# EAGLE design SNES (EAGLE 9.6.2)
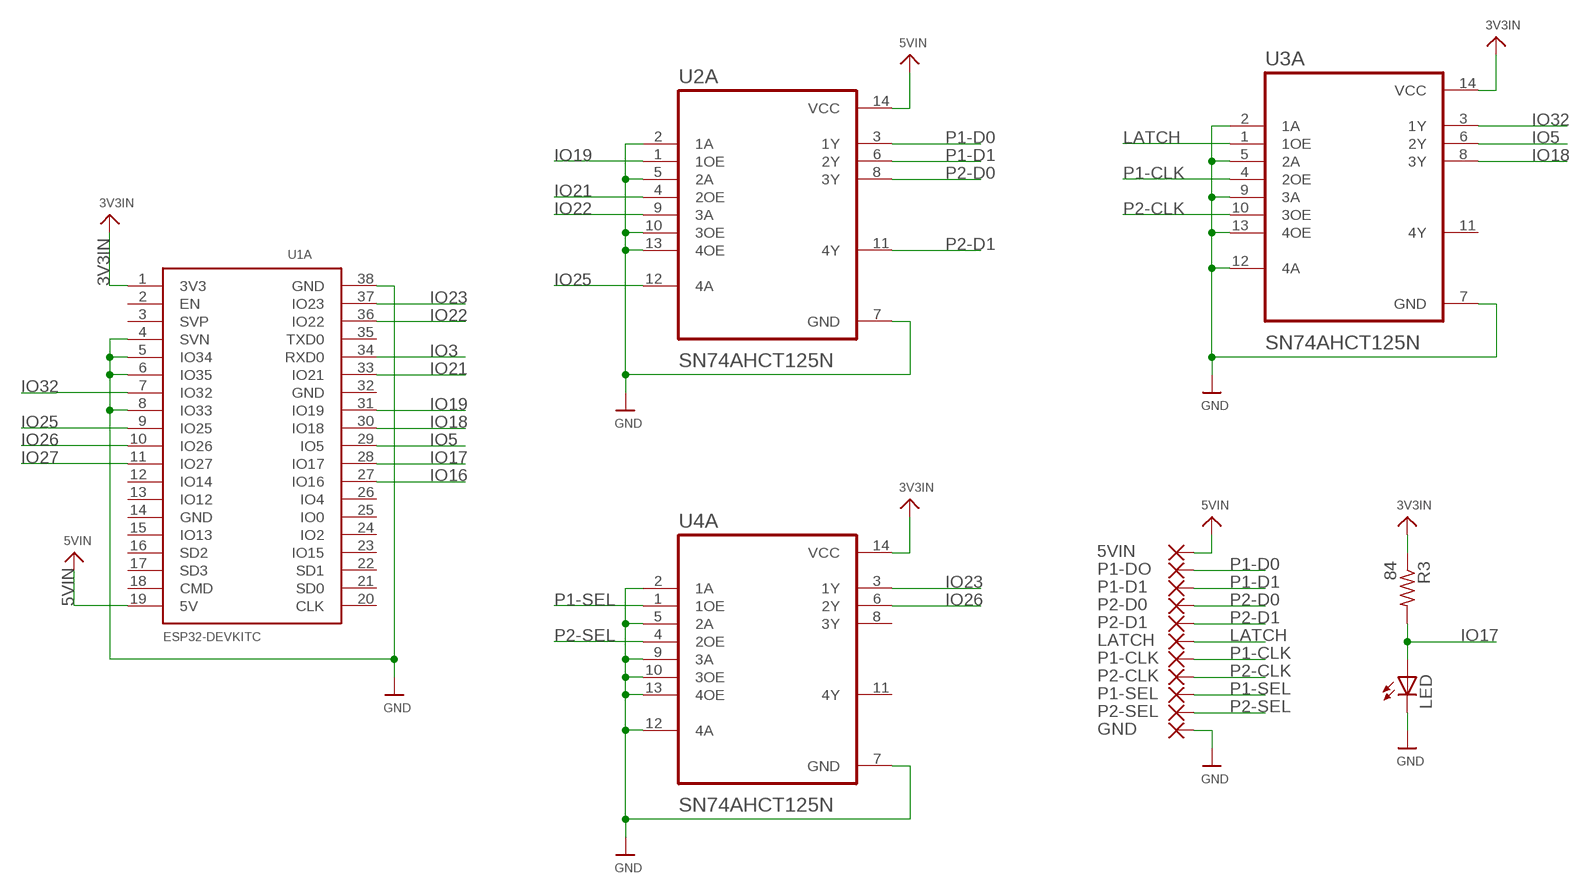
[diagram p0: schematic, sheet 1]

## Parts
5VIN  SMD5  [SMD2,54-5,08]
GND  SMD5  [SMD2,54-5,08]
LATCH  SMD5  [SMD2,54-5,08]
LED  LEDCHIPLED_1206  [CHIPLED_1206]
P1-CLK  SMD5  [SMD2,54-5,08]
P1-D1  SMD5  [SMD2,54-5,08]
P1-DO  SMD5  [SMD2,54-5,08]
P1-SEL  SMD5  [SMD2,54-5,08]
P2-CLK  SMD5  [SMD2,54-5,08]
P2-D0  SMD5  [SMD2,54-5,08]
P2-D1  SMD5  [SMD2,54-5,08]
P2-SEL  SMD5  [SMD2,54-5,08]
R3  84  R-US_R1206  [R1206]
U1A  ESP32DEVKITC  [ESP32-DEVKITC]
U2A  SN74AHCT125N  [DIP794W45P254L1969H508Q14]
U3A  SN74AHCT125N  [DIP794W45P254L1969H508Q14]
U4A  SN74AHCT125N  [DIP794W45P254L1969H508Q14]

## Nets
3V3IN: R3.1 U1A.1(3V3) U3A.14(VCC) U4A.14(VCC)
5VIN: 5VIN.1(P) U1A.19(5V) U2A.14(VCC)
GND: GND.1(P) LED.C U1A.4(SVN) U1A.5(IO34) U1A.6(IO35) U1A.8(IO33) U1A.38(GND) U2A.2(1A) U2A.5(2A) U2A.7(GND) U2A.10(3OE) U2A.13(4OE) U3A.2(1A) U3A.5(2A) U3A.7(GND) U3A.9(3A) U3A.12(4A) U3A.13(4OE) U4A.2(1A) U4A.5(2A) U4A.7(GND) U4A.9(3A) U4A.10(3OE) U4A.12(4A) U4A.13(4OE)
IO3: U1A.34(RXD0)
IO5: U1A.29(IO5) U3A.6(2Y)
IO16: U1A.27(IO16)
IO17: LED.A R3.2 U1A.28(IO17)
IO18: U1A.30(IO18) U3A.8(3Y)
IO19: U1A.31(IO19) U2A.1(1OE)
IO21: U1A.33(IO21) U2A.4(2OE)
IO22: U1A.36(IO22) U2A.9(3A)
IO23: U1A.37(IO23) U4A.3(1Y)
IO25: U1A.9(IO25) U2A.12(4A)
IO26: U1A.10(IO26) U4A.6(2Y)
IO27: U1A.11(IO27)
IO32: U1A.7(IO32) U3A.3(1Y)
LATCH: LATCH.1(P) U3A.1(1OE)
P1-CLK: P1-CLK.1(P) U3A.4(2OE)
P1-D0: P1-DO.1(P) U2A.3(1Y)
P1-D1: P1-D1.1(P) U2A.6(2Y)
P1-SEL: P1-SEL.1(P) U4A.1(1OE)
P2-CLK: P2-CLK.1(P) U3A.10(3OE)
P2-D0: P2-D0.1(P) U2A.8(3Y)
P2-D1: P2-D1.1(P) U2A.11(4Y)
P2-SEL: P2-SEL.1(P) U4A.4(2OE)
Unconnected: U1A.2(EN) U1A.3(SVP) U1A.12(IO14) U1A.13(IO12) U1A.14(GND) U1A.15(IO13) U1A.16(SD2) U1A.17(SD3) U1A.18(CMD) U1A.20(CLK) U1A.21(SD0) U1A.22(SD1) U1A.23(IO15) U1A.24(IO2) U1A.25(IO0) U1A.26(IO4) U1A.32(GND) U1A.35(TXD0) U3A.11(4Y) U4A.8(3Y) U4A.11(4Y)

## Library data of the parts
5VIN GND LATCH P1-CLK P1-D1 P1-DO P1-SEL P2-CLK P2-D0 P2-D1 P2-SEL = wirepad:SMD5: SMD PAD
LED = adafruit:LED: LED OSRAM: - CHIPLED LG R971, LG N971, LY N971, LG Q971, LY Q971, LO R971, LY R971 LH N974, LH R974 LS Q976, LO Q976, LY Q976 LO Q996 - Hyper CHIPLED LW Q18S LB Q993, LB Q99A, LB R99A - SideLED LS A670, LO A670, LY A670, LG A670, LP A670 LB A673, LV A673, LT A673, LW A673 LH A674 LY A675 LS A676, LA A676, LO A676, LY A676, LW A676 LS A679, LY A679, LG A679 - Hyper Micro SIDELED® LS Y876, LA Y876, LO Y876, LY Y876 LT Y87S - SmartLED LW L88C, LW L88S LB L89C, LB L89S, LG L890 LS L89K, LO L89K, LY L89K LS L896, LA L896, LO L896, LY L896 - TOPLED LS T670, LO T670, LY T670, LG T670, LP T670 LSG T670, LSP T670, LSY T670, LOP T670, LYG T670 LG T671, LOG T671, LSG T671 LB T673, LV T673, LT T673, LW T673 LH T674 LS T676, LA T676, LO T676, LY T676, LB T676, LH T676, LSB T676, LW T676 LB T67C, LV T67C, LT T67C, LS T67K, LO T67K, LY T67K, LW E67C LS E67B, LA E67B, LO E67B, LY E67B, LB E67C, LV E67C, LT E67C LW T67C LS T679, LY T679, LG T679 LS T770, LO T770, LY T770, LG T770, LP T770 LB T773, LV T773, LT T773, LW T773 LH T774 LS E675, LA E675, LY E675, LS T675 LS T776, LA T776, LO T776, LY T776, LB T776 LHGB T686 LT T68C, LB T68C - Hyper Mini TOPLED® LB M676 - Mini TOPLED Santana® LG M470 LS M47K, LO M47K, LY M47K Source: http://www.osram.convergy.de/
R3 = adafruit:R-US_: RESISTOR, American symbol
U1A = ESP32-DEVKITC:ESP32DEVKITC
U2A U3A U4A = SN74AHCT125N:SN74AHCT125N: None Check prices <https://pricing.snapeda.com/parts/SN74AHCT125N/Texas%20Instruments/view-part?ref=eda>; AVAILABILITY: In Stock; DESCRIPTION: Quadruple Bus Buffer Gates With 3-State Outputs 14-PDIP -40 to 125; MF: Texas Instruments; MP: SN74AHCT125N; PACKAGE: PDIP-14 Texas Instruments; PRICE: None; PURCHASE-URL: https://pricing.snapeda.com/search/part/SN74AHCT125N/?ref=eda

## Board
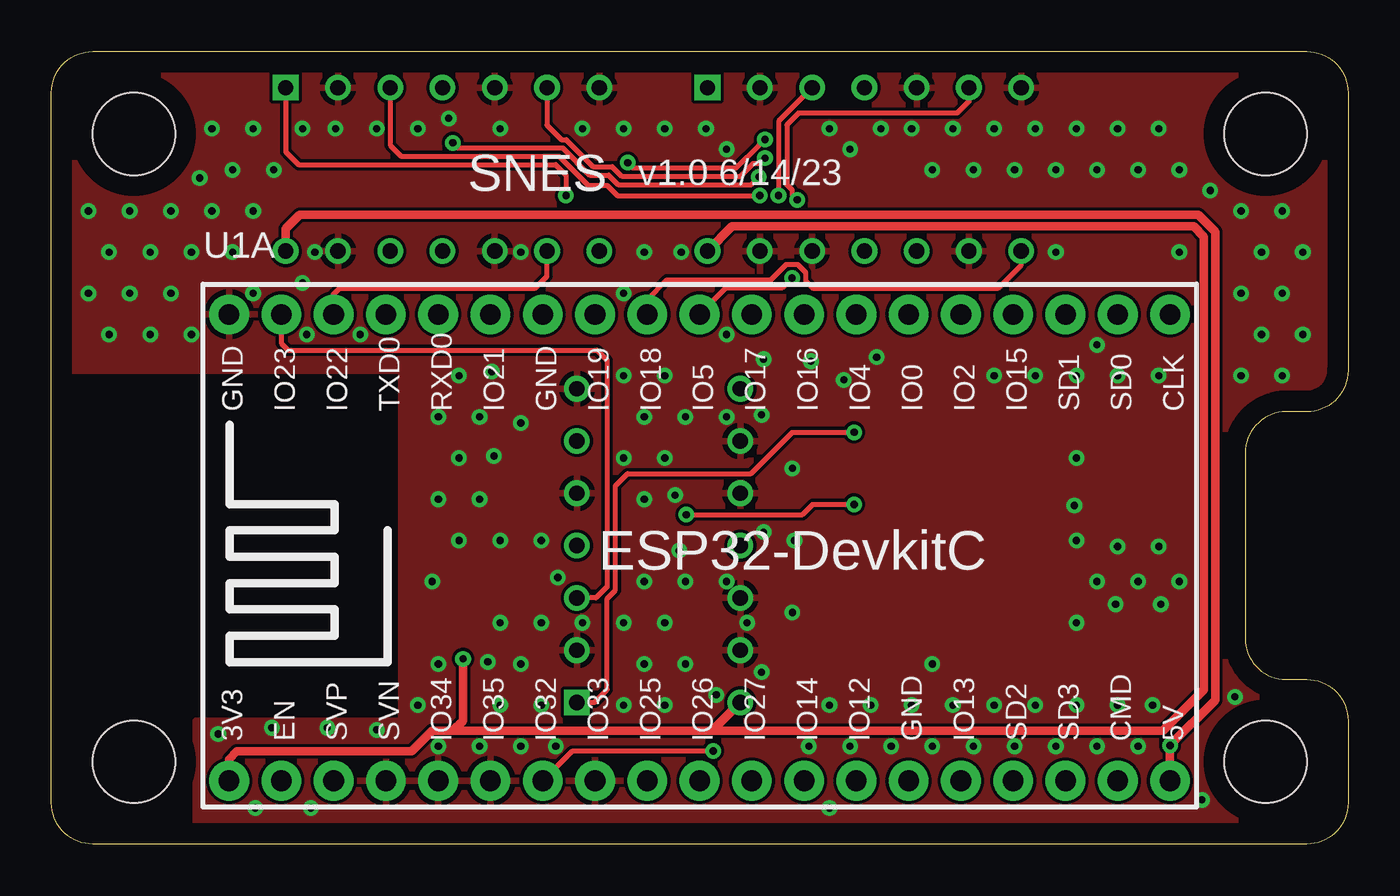
[diagram p1: board, top side]
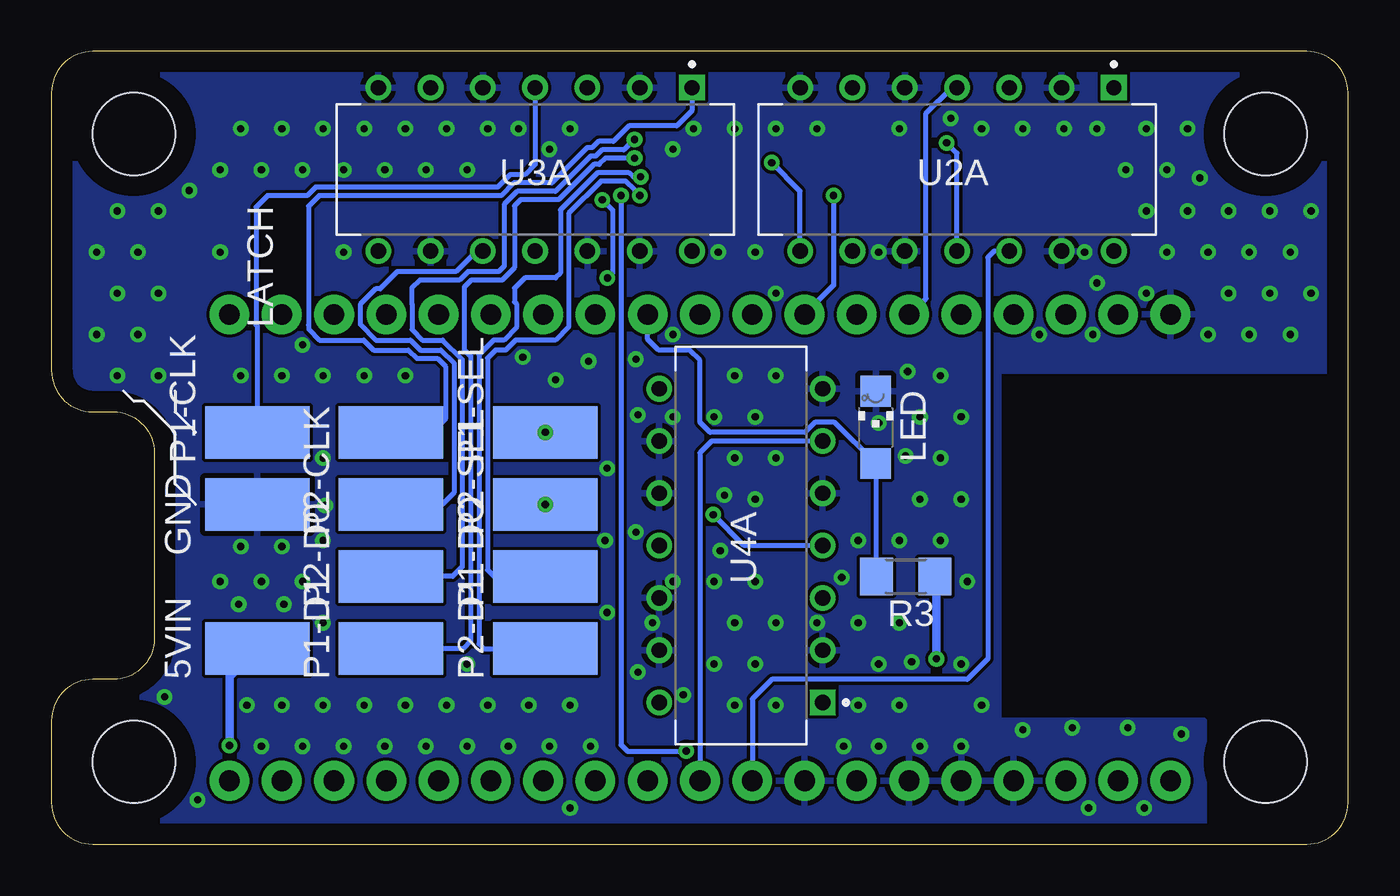
[diagram p2: board, bottom side, seen from below]

Size 63 x 38.5 mm. Coordinates in mm from the lower left corner, seen from the top.
Outline: 0,2 0,36.5 arc-90 2,38.5 61,38.5 arc-90 63,36.5 63,23 arc-90 61,21 60,21 arc90 58,19 58,10 arc90 60,8 61,8 arc-90 63,6 63,2 arc-90 61,0 2,0 arc-90 0,2
Copper layers (1*16): Top 0.035mm / dielectric 1.5mm / Bottom 0.035mm
Design rules "default": minimum track width 6mil, minimum drill 0.35mm, track to track 6mil, track to pad 6mil, pad to pad 6mil, via to via 6mil, smd to smd 6mil, copper to edge 40mil, drill to drill 6mil, minimum pad ring 10mil, minimum via ring 8mil, stop-mask expansion 4mil, vias tented up to drill 0.5mm, thermal gap 10mil
Holes 4 mm at 4,4 4,34.5 59,34.5 59,4

### Footprints (pad centres in the part's own frame; a part is rotated, then mirrored left to right if it is on the bottom)
SMD2,54-5,08 = smd 2.54 x 5.08: 1 0,0
CHIPLED_1206 = smd 1.5 x 1.5: A 0,-1.75; C 0,1.75
R1206 = smd 1.6 x 1.803: 1 -1.422,0; 2 1.422,0
ESP32-DEVKITC = drill 1 pad 1.93: 1 -22.87,-11.42; 2 -20.33,-11.42; 3 -17.79,-11.42; 4 -15.25,-11.42; 5 -12.71,-11.42; 6 -10.17,-11.42; 7 -7.63,-11.42; 8 -5.09,-11.42; 9 -2.55,-11.42; 10 -0.01,-11.42; 11 2.53,-11.42; 12 5.07,-11.42; 13 7.61,-11.42; 14 10.15,-11.42; 15 12.69,-11.42; 16 15.23,-11.42; 17 17.77,-11.42; 18 20.31,-11.42; 19 22.85,-11.42; 20 22.85,11.23; 21 20.31,11.23; 22 17.77,11.23; 23 15.23,11.23; 24 12.69,11.23; 25 10.15,11.23; 26 7.61,11.23; 27 5.07,11.23; 28 2.53,11.23; 29 -0.01,11.23; 30 -2.55,11.23; 31 -5.09,11.23; 32 -7.63,11.23; 33 -10.17,11.23; 34 -12.71,11.23; 35 -15.25,11.23; 36 -17.79,11.23; 37 -20.33,11.23; 38 -22.87,11.23
DIP794W45P254L1969H508Q14 = drill 0.74 pad 1.14 square: 1 -3.97,7.62 | drill 0.74 pad 1.14: 2 -3.97,5.08; 3 -3.97,2.54; 4 -3.97,0; 5 -3.97,-2.54; 6 -3.97,-5.08; 7 -3.97,-7.62; 8 3.97,-7.62; 9 3.97,-5.08; 10 3.97,-2.54; 11 3.97,0; 12 3.97,2.54; 13 3.97,5.08; 14 3.97,7.62

### Placement (x,y rotation side)
5VIN  53,9.5 270 bottom
GND  53,16.5 270 bottom
LATCH  46.5,20 270 bottom
LED  22.95,20.24 0 bottom
P1-CLK  53,20 270 bottom
P1-D1  46.5,9.5 270 bottom
P1-DO  39,13 270 bottom
P1-SEL  39,20 270 bottom
P2-CLK  46.5,16.5 270 bottom
P2-D0  46.5,13 270 bottom
P2-D1  39,9.5 270 bottom
P2-SEL  39,16.5 270 bottom
R3  21.5,13 180 bottom
U1A  31.5,14.5 0 top
U2A  19,32.77 270 bottom
U3A  39.5,32.77 270 bottom
U4A  29.5,14.5 180 bottom

### Tracks (layer width: path | path; a pad name or v marks a point on that pad's centre or on a via)
3V3IN  (via drill 0.35)
  Top 0.406: U1A.1 8.63,4.13 9,4.5 17.5,4.5 18.5,5.5 19.5,5.5 | U4A.14 32.09,5.5 | 19.5,5.5 32.09,5.5 | 32.09,5.5 54,5.5 56,7.5 56,29.5 55.5,30 33.08,30 U3A.14 | v20,9 20,6 19.5,5.5
  Bottom 0.406: R3.1 20,12.92 v20,9
5VIN  (via drill 0.35)
  Top 0.406: U1A.19 v54.35,4.79 56.56,7 56.56,29.73 55.73,30.56 12.06,30.56 11.38,29.88 U2A.14
  Bottom 0.406: 5VIN.1 54.35,8.15 v54.35,4.79
GND  (via drill 0.35)
  other vias: 2.8,24.75 1.8,26.75 2.8,28.75 1.8,30.75 4.8,24.75 3.8,26.75 4.8,28.75 3.8,30.75 6.8,24.75 5.8,26.75 6.8,28.75 5.8,30.75 7.2,32.35 15.8,5.55 8.8,28.75 7.8,30.75 8.8,32.75 7.8,34.75 9.9,1.75 9.8,26.75 9.8,30.75 10.8,32.75 9.8,34.75 12.6,1.75 12.4,24.75 12.2,27.25 12.8,28.75 12.2,34.75 15,24.75 13.8,34.75 15.8,34.75 18.8,4.75 17.8,6.75 18.8,8.75 18.5,12.75 18.8,16.75 18.8,20.75 17.8,34.75 20.8,4.75 21.2,8.85 19.8,14.75 20.8,16.75 19.8,18.75 20.8,20.75 19.8,22.75 19.3,35.25 22.8,4.75 21.8,6.75 22.8,8.75 21.8,10.75 21.8,14.75 21.5,18.85 22.8,20.45 21.4,22.95 40.1,23.65 22.8,28.75 21.8,34.75 24.5,4.75 23.8,6.75 23.8,10.75 24.6,12.95 23.8,14.75 38.5,22.55 25.8,10.75 25.8,34.75 27.8,6.75 28.8,8.75 27.8,10.75 28.8,12.75 28.8,16.75 27.8,18.75 28.8,20.75 27.8,22.75 27.8,26.75 28.8,28.75 27.8,34.75 29.8,6.75 30.8,8.75 29.8,10.75 30.8,12.75 30.3,16.95 29.8,18.75 30.8,20.75 29.8,22.75 36.9,23.45 30.6,28.75 29.8,34.75 32.3,7.25 32.8,12.75 32.8,20.75 32.8,24.75 36,18.25 32.8,33.75 31.8,34.75 34.5,8.35 33.8,10.75 8.1,5.35 34.6,15.15 34.5,20.85 34.6,23.55 36.8,4.75 13.4,5.65 10.7,5.65 30.5,14.25 37.8,1.75 38.8,4.75 37.8,6.75 36.1,14.75 38.8,33.75 37.8,34.75 40.8,4.75 39.8,6.75 36,11.25 40.3,34.75 42.8,4.75 41.8,6.75 42.8,8.75 42.8,32.75 41.8,34.75 44.8,4.75 43.8,6.75 57.5,7.15 44.8,32.75 43.8,34.75 46.8,4.75 45.8,6.75 53.9,11.65 45.8,22.75 46.8,32.75 45.8,34.75 48.8,4.75 47.8,6.75 51.7,11.65 47.8,22.75 48.8,28.75 48.8,32.75 47.8,34.75 50.8,4.75 49.8,6.75 49.8,10.75 50.8,12.75 49.8,14.75 49.8,18.75 49.8,22.75 50.8,24.25 50.8,32.75 49.8,34.75 52.8,4.75 51.8,6.75 52.8,12.75 51.8,14.45 49.7,16.45 51.8,22.75 52.8,32.75 51.8,34.75 53.5,6.75 54.8,12.75 53.8,14.45 53.8,22.75 54.8,28.75 54.8,32.75 53.8,34.75 55.9,2.15 56.3,31.75 57.8,22.75 58.8,24.75 57.8,26.75 58.8,28.75 57.8,30.75 59.8,22.75 60.8,24.75 59.8,26.75 60.8,28.75 59.8,30.75
  pour Bottom: 7,0 63,0 63,38.5 0,38.5 0,23 17,23 17,6 7,6
  pour Top: 0,38.5 0,23 17,23 17,6 7,6 7,0 63,0 63,38.5
IO5  (via drill 0.35)
  Top 0.254: U3A.6 44.58,36.08 44,35.5 36.29,35.5 35.73,34.94 35.73,32.02 35.98,31.77 35.98,31.54 v36.23,31.29 | v35.98,27.5 35.48,27 32.76,27 U1A.29
  Bottom 0.254: v36.23,31.29 35.73,30.79 35.73,27.75 v35.98,27.5
IO17
  Bottom 0.254: R3.2 22.92,18.46 LED.A 24.94,20.48 25.9,20.48 26.39,20 31,20 31.5,20.5 31.5,23.5 32,24 33.5,24 34.03,24.53 U1A.28
IO18
  Top 0.254: U3A.8 47.12,28.12 46,27 37,27 36.64,27.36 36.64,27.77 36.26,28.16 35.71,28.16 34.96,27.41 29.91,27.41 28.95,26.45 U1A.30
IO19  (via drill 0.35)
  Top 0.254: U2A.1 11.38,33.62 12,33 24.5,33 25,32.5 v25,31.5
  Bottom 0.254: U1A.31 25,27.14 v25,31.5
IO21
  Bottom 0.254: U1A.33 21.27,25.73 20.5,26.5 20.5,35.5 19.26,36.74 U2A.4
IO22
  Top 0.254: U1A.36 13.71,26.71 14,27 23.5,27 24.08,27.58 U2A.9
IO23
  Top 0.254: U1A.37 11.17,24.33 11.5,24 26.5,24 27,23.5 27,12.5 26.46,11.96 U4A.3
IO25
  Bottom 0.254: U2A.12 17.2,28.8 17.5,28.5 17.5,9 18.5,8 28,8 28.95,7.05 U1A.9
IO26
  Bottom 0.254: U4A.6 30.92,19.58 31.5,19 U1A.10
IO32  (via drill 0.35)
  Top 0.254: v32.16,4.53 32.13,4.5 25.29,4.5 U1A.7 | U3A.3 35.33,35.11 v35.33,31.5
  Bottom 0.254: v32.16,4.53 32.19,4.5 35,4.5 35.33,4.83 v35.33,31.5
LATCH
  Bottom 0.254: U3A.1 31.88,35.62 32.62,34.88 34.94,34.88 35.69,34.13 36.42,34.13 36.72,33.83 36.97,33.83 38.69,32.11 40.54,32.11 41.15,31.5 50,31.5 50.52,30.98 50.52,25.21 50.5,25.2 50.5,25 49.98,24.48 47.82,24.48 47.34,24 45.65,24 45.24,23.59 44.24,23.59 43.85,23.2 43.85,20.65 44.5,20 LATCH.1
P1-CLK
  Bottom 0.254: P1-CLK.1 53,25.16 53.05,25.21 53.05,30.95 52.5,31.5 50.58,31.5 50.17,31.91 41.32,31.91 40.7,32.52 40,32.52 39.5,33.02 U3A.4
P1-D0  (via drill 0.35)
  Top 0.254: U2A.3 16.46,33.95 17,33.41 24.67,33.41 26.07,32 27,32 27.5,31.5 v34.42,31.5
  Bottom 0.254: v34.42,31.5 34.67,31.75 34.67,31.77 35.09,32.2 36.3,32.2 37.87,30.64 37.87,25.14 38.52,24.48 40.44,24.48 40.92,24 41.42,24 41.82,23.61 41.82,13.32 41.5,13 P1-DO.1
P1-D1  (via drill 0.35)
  Top 0.254: U2A.6 24.08,34.92 24.78,34.22 25,34.22 26.32,32.91 27.24,32.91 27.71,32.44 33.48,32.44 34.1,33.07 34.42,33.07 v34.67,33.32
  Bottom 0.254: v34.67,33.32 36.08,33.32 36.39,33.01 36.64,33.01 38.35,31.3 40.2,31.3 40.5,31 40.5,28 41.1,27.4 42.6,27.4 42.95,27.05 42.95,24.02 42.63,23.71 42.63,9.87 43,9.5 P1-D1.1
P1-SEL  (via drill 0.35)
  Top 0.254: U4A.1 26.38,6.88 27,7.5 27,11.93 27.41,12.33 27.41,17.41 28,18 34,18 36,20 P1-SEL.1
  other vias: 39,20
P2-CLK
  Bottom 0.254: U3A.10 42.35,28.8 43.34,27.81 46.19,27.81 47.02,26.98 47.25,26.98 48,26.22 48,25.24 47.25,24.48 45.56,24.48 45.08,24 44.08,24 43.45,23.37 43.45,17.05 44,16.5 P2-CLK.1
P2-D0  (via drill 0.35)
  Top 0.254: v28,33.1 28.25,32.85 33.27,32.85 34.4,33.98 34.42,33.98 v34.67,34.23
  Bottom 0.254: U2A.8 26.62,31.72 v28,33.1 | v34.67,34.23 34.92,33.98 34.94,33.98 35.19,33.72 36.25,33.72 36.56,33.42 36.8,33.42 38.52,31.71 40.37,31.71 41,31.07 41,28.07 41.27,27.81 42.77,27.81 43.17,27.4 45.1,27.4 45.5,27 45.5,26.26 45.48,26.25 45.48,24.98 44.98,24.48 43.98,24.48 43.04,23.54 43.04,13.46 43.5,13 P2-D0.1
P2-D1  (via drill 0.35)
  Top 0.254: v19.5,34.06 19.75,33.81 24.84,33.81 26.15,32.5 27.07,32.5 27.54,32.04 34,32.04 v34.37,32.41
  Bottom 0.254: U2A.11 19,33.56 v19.5,34.06 | v34.37,32.41 34.73,32.41 34.93,32.61 36.47,32.61 38.27,30.8 38.27,27.73 38.5,27.5 40,27.5 40.5,27 40.5,26.34 40.41,26.25 40.41,25.09 41.02,24.48 41.52,24.48 42.23,23.77 42.23,9.73 42,9.5 P2-D1.1
P2-SEL  (via drill 0.35)
  Top 0.254: v30.84,16 36.5,16 37,16.5 P2-SEL.1
  Bottom 0.254: U4A.4 29.34,14.5 v30.84,16
  other vias: 39,16.5

### Text on the board
tPlace: SNES | v1.0 6/14/23